# Altium schematic sheet Communication Interfaces.SchDoc
size A4; SheetNumber: 3; SheetTotal: 3
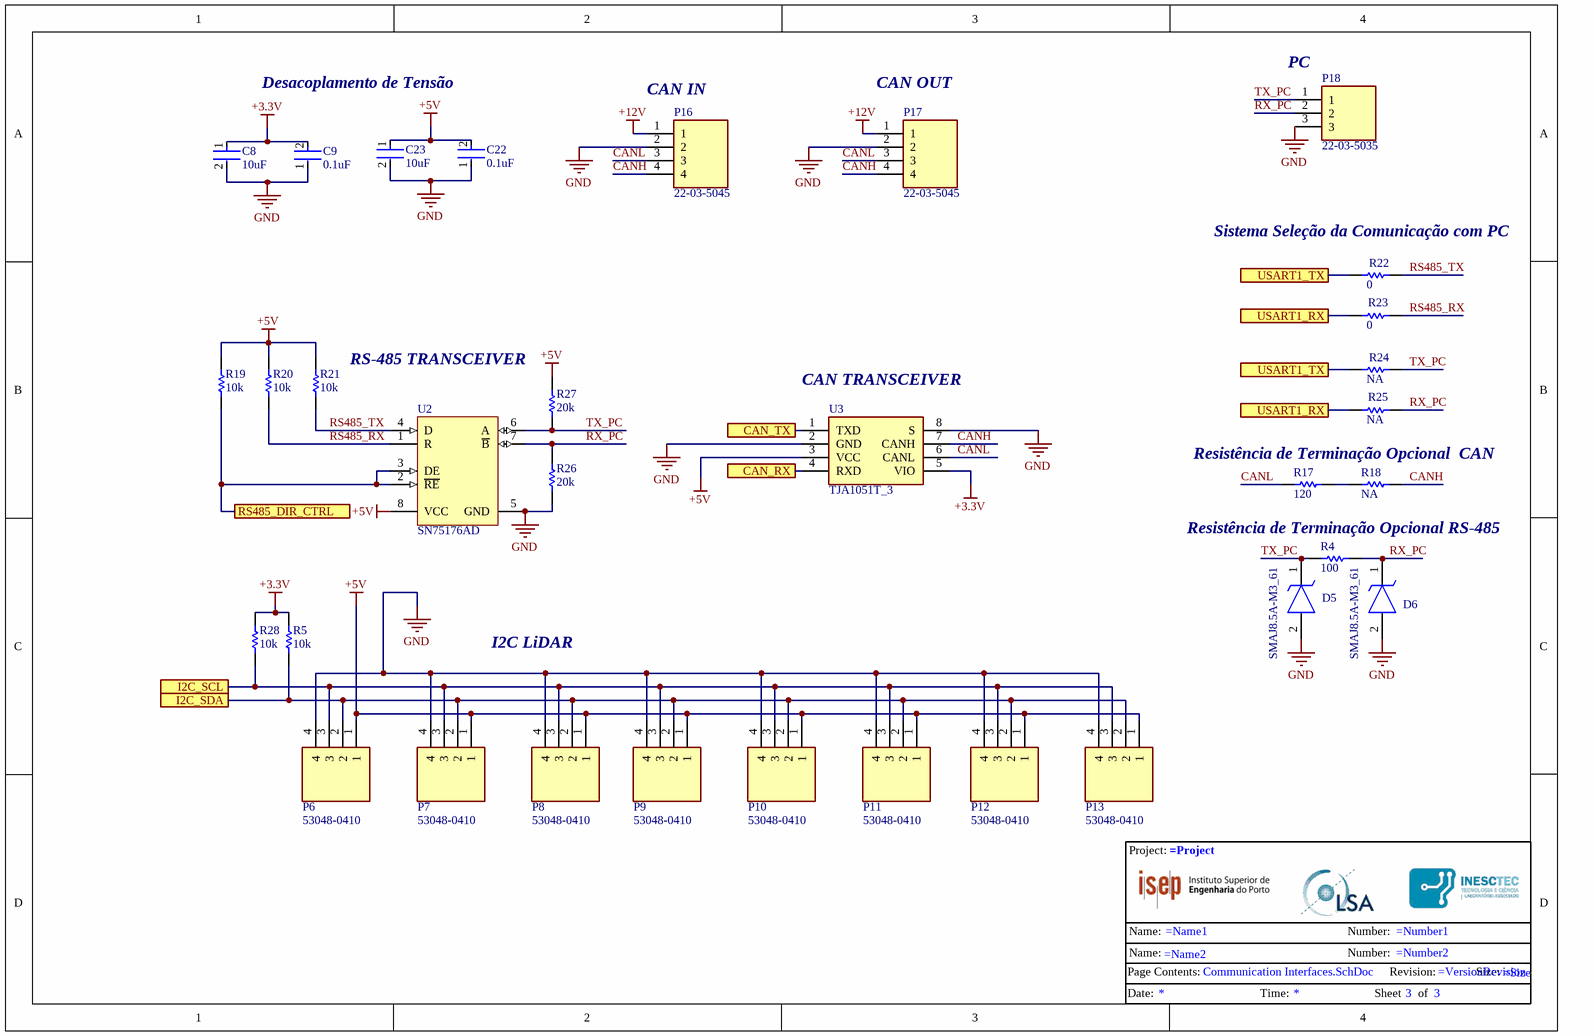
[diagram p0: Communication Interfaces.SchDoc]

## Parts
?  Title_Block  (value not drawn)  (graphical)
C8  10uF  [FP-C3216-160-0_2-IPC_C]
C9  0.1uF  [FP-GRM15-MFG]
C22  0.1uF  [FP-GRM15-MFG]
C23  10uF  [FP-C3216-160-0_2-IPC_C]
D5  SMAJ8.5A-M3_61  [DIOM5127X229N]
D6  SMAJ8.5A-M3_61  [DIOM5127X229N]
P6  53048-0410  [530480410]
P7  53048-0410  [530480410]
P8  53048-0410  [530480410]
P9  53048-0410  [530480410]
P10  53048-0410  [530480410]
P11  53048-0410  [530480410]
P12  53048-0410  [530480410]
P13  53048-0410  [530480410]
P16  22-03-5045  [SHDR4W70P0X250_1X4_1240X490X610P]
P17  22-03-5045  [SHDR4W70P0X250_1X4_1240X490X610P]
P18  22-03-5035  [SHDR3W60P0X250_1X3_990X490X590P]
R4  100  [RESC1608X55X30ML20T20]
R5  10k  [RESC1608X55X30ML20T20]
R17  120  [RESC1608X55X30ML20T20]
R18  NA  [RESC1608X55X30ML20T20]
R19  10k  [RESC1608X55X30ML20T20]
R20  10k  [RESC1608X55X30ML20T20]
R21  10k  [RESC1608X55X30ML20T20]
R22  0  [RESC1608X55X30ML20T20]
R23  0  [RESC1608X55X30ML20T20]
R24  NA  [RESC1608X55X30ML20T20]
R25  NA  [RESC1608X55X30ML20T20]
R26  20k  [RESC1608X55X30ML20T20]
R27  20k  [RESC1608X55X30ML20T20]
R28  10k  [RESC1608X55X30ML20T20]
U2  SN75176AD  [D0008A_M]
U3  TJA1051T_3  [SOIC127P600X175-8N]

## Ports
CAN_RX, CAN_TX, I2C_SCL, I2C_SDA, RS485_DIR_CTRL, USART1_RX, USART1_TX

## Nets
+3.3V: C8.1 C9.2 R5.2 R28.2 U3.5(VIO)
+5V: C22.2 C23.1 P6.1 P7.1 P8.1 P9.1 P10.1 P11.1 P12.1 P13.1 R19.2 R20.2 R21.2 R27.1 U2.8(VCC) U3.3(VCC)
+12V: P16.1 P17.1
GND: C8.2 C9.1 C22.1 C23.2 D5.2(A) D6.2(A) P6.4 P7.4 P8.4 P9.4 P10.4 P11.4 P12.4 P13.4 P16.2 P17.2 P18.3 R26.2 U2.5(GND) U3.2(GND) U3.8(S)
CAN_RX: U3.4(RXD) ; port CAN_RX
CAN_TX: U3.1(TXD) ; port CAN_TX
CANH: P16.4 P17.4 R18.1 U3.7(CANH)
CANL: P16.3 P17.3 R17.2 U3.6(CANL)
I2C_SCL: P6.3 P7.3 P8.3 P9.3 P10.3 P11.3 P12.3 P13.3 R28.1 ; port I2C_SCL
I2C_SDA: P6.2 P7.2 P8.2 P9.2 P10.2 P11.2 P12.2 P13.2 R5.1 ; port I2C_SDA
RS485_DIR_CTRL: R19.1 U2.2(~{RE}) U2.3(DE) ; port RS485_DIR_CTRL
RS485_RX: R20.1 R23.1 U2.1(R)
RS485_TX: R21.1 R22.1 U2.4(D)
RX_PC: D6.1(K) P18.2 R4.1 R25.1 R26.1 U2.7(~{B})
TX_PC: D5.1(K) P18.1 R4.2 R24.1 R27.2 U2.6(A)
USART1_RX: R23.2 R25.2 ; port USART1_RX
USART1_TX: R22.2 R24.2 ; port USART1_TX
NetR17_1: R17.1 R18.2

## Notes on the sheet
- Desacoplamento de Tensão
- (near P16) CAN IN
- (near P17) CAN OUT
- (near P18) PC
- (near R22) Sistema Seleção da Comunicação com PC
- RS-485 TRANSCEIVER
- (near U3) CAN TRANSCEIVER
- Resistência de Terminação Opcional  CAN
- (near R4) Resistência de Terminação Opcional RS-485
- I2C LiDAR
- (in symbol Title_Block) Project:; Name:; Number:; Page Contents:; Revision:; Size:; Date:; Time:; Sheet; of

## Library data of the parts
C8 C23 = CMP-08246-003443-1: Multilayer Ceramic Capacitors 10uF ±10% 16V X5R SMD 1206; Packaging: Tape and Reel; Thickness: 0.071inch; REACH SVHC: No SVHC; Lead Free: Lead Free; Voltage: 16V; Case Code (Imperial): 1206; RoHS Compliant: Yes; Dielectric Material: Ceramic; Termination: SMD/SMT; Resistor Type: Ceramic; Dielectric: X5R; Width: 0.063inch; Construction: Flat; Length: 3.2mm; Voltage Rating (DC): 16V; Case/Package: 1206; Series: C; Package Quantity: 1; Weight: 0.000571oz; Height: 1.6mm; Voltage Rating: 16V; Tolerance: 10%; Case Code (Metric): 3216; Max Operating Temperature: 85°C; Mount: Surface Mount; Min Operating Temperature: -55°C; Depth: 1.6mm; Radiation Hardening: No; Capacitance: 10uF
C9 C22 = CMP-2100-03641-2: CAP CER 0.1UF 16V X7R 0402; Manufacturer Part Number: GRM155R71C104KA88D; Manufacturer: Murata; Standoff Height: 0mm; Tolerance: 10%; Voltage Rating: 16Vdc; Material: Ceramic; Capacitance: 0.10μF; Value: 0.10μF; RoHS: TRUE; Temperature Characteristic: X7R; Octopart: https://octopart.com/grm155r71c104ka88d-murata-196880; Digikey Description: CAP CER 0.1UF 16V X7R 0402; Device Class L3: Ceramic Capacitors; Height: 0.55mm; ComponentLink2Description: Datasheet; Temperature Range Low: -55°C; Ipc Land Pattern Name: CAPC10050X219; ComponentLink2URL: https://search.murata.co.jp/Ceramy/image/img/A01X/G101/ENG/GRM155R71H471KA01-01A.pdf; Device Class L1: Passive Components; Lead Free: yes; Category: Cap; Package: GRM15; Temperature: -55°C to +125°C; Device Class L2: Capacitors; Temperature Range High: +125°C; Mouser Description: 0402 0.1 uF 16V ±10 % Tolerance X7R SMT Multilayer Ceramic Capacitor
D5 D6 = SMAJ8.5A-M3_61: TVS Diode (Uni-directional); Manufacturer_Name: Vishay; Manufacturer_Part_Number: SMAJ8.5A-M3/61; Datasheet Link: http://www.alldatasheet.com/view.jsp?Searchword=SMAJ8.5A-M3/61; Height: 2.29mm
P6-P13 = 53048-0410: Connector; Manufacturer_Name: Molex; Datasheet Link: https://www.molex.com/pdm_docs/sd/530480410_sd.pdf; Height: 3.7mm; Manufacturer_Part_Number: 53048-0410; Mouser Part Number: 538-53048-0410; Mouser Price/Stock: https://www.mouser.co.uk/ProductDetail/Molex/53048-0410?qs=359VwiUTsp2msj5Tobchuw%3D%3D
P16 P17 = 22-03-5045: Connector; Manufacturer_Name: Molex; Datasheet Link: https://componentsearchengine.com/Datasheets/2/22-03-5045.pdf; Height: 6.1mm; Manufacturer_Part_Number: 22-03-5045; Mouser Part Number: 538-22-03-5045; Mouser Price/Stock: https://www.mouser.co.uk/ProductDetail/Molex/22-03-5045?qs=ZDXmSm13592ymm0ujoo9aQ%3D%3D
P18 = 22-03-5035: Connector; Manufacturer_Name: Molex; Datasheet Link: http://www.molex.com/pdm_docs/sd/022035035_sd.pdf; Height: 5.9mm; Manufacturer_Part_Number: 22-03-5035; Mouser Part Number: 538-22-03-5035; Mouser Price/Stock: https://www.mouser.co.uk/ProductDetail/Molex/22-03-5035?qs=VKrXD49J9Ep%252Bv2WwbOoiPA%3D%3D
R4 R5 R17-R28 = CMP-2000-00897-1: Manufacturer: Panasonic; Part Number: ERA3AEB122V
U2 = CMP-0310-00139-2: Differential Bus Transceiver, 1 TX / 1 RX, 5V, 0 to 70 degC, 8-Pin SOIC (D), Green (RoHS & no Sb/Br); Manufacturer: Texas Instruments; Rating: Catalog; ESD(kV): 2; Supply Voltage(s)(V): 5; Receivers Per Package: 1; ICC(Max)(mA): 50; SubFamily: RS-422; DatasheetVersion: SLLS100A; Footprint: SN75176; PackageDescription: 8-Pin Plastic Small Outline Integrated Circuit, 4.9 x 3.9 mm, Pitch 1.27 mm Pitch; ComponentLink2Description: Package Specification; # of TX/RX: 1 TX / 1 RX; ComponentLink2URL: http://www.ti.com/lit/ml/msoi002j/msoi002j.pdf; PartNumber: SN75176AD; Drivers Per Package: 1; PackageVersion: revM, Jun-2011; Eco-Plan: Green (RoHS & no Sb/Br); Isolated: No; Mounting Technology: Surface Mount; PackageReference: D0008A; Code_JEDEC: MS-012AA; ComponentLink1URL: http://www.ti.com/general/docs/lit/getliterature.tsp?genericPartNumber=SN75176A&fileType=pdf; ComponentLink1Description: Datasheet
U3 = TJA1051T_3_CM,118: Integrated Circuit; Manufacturer_Name: NXP; Manufacturer_Part_Number: TJA1051T/3/CM,118; Datasheet Link: http://www.nxp.com/docs/en/data-sheet/TJA1051.pdf; Height: 1.75mm; Mouser Part Number: 771-TJA1051T/3CM118; Mouser Price/Stock: https://www.mouser.co.uk/ProductDetail/NXP-Semiconductors/TJA1051T-3-CM118?qs=5XOdhvmYM0NUkmo%252BpXvJfw%3D%3D; Arrow Part Number: TJA1051T/3/CM,118; Arrow Price/Stock: https://www.arrow.com/en/products/tja1051t3cm118/nxp-semiconductors?region=nac